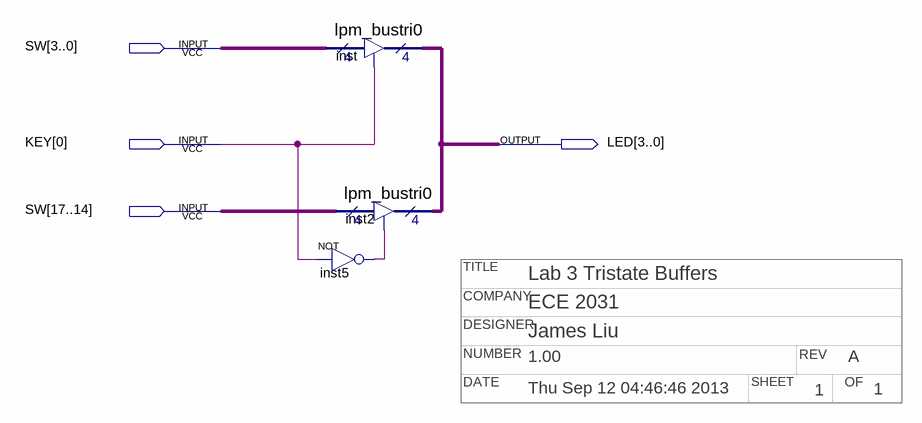
[diagram p0: schematic sheet]
// Quartus schematic tristate.bdf as structural Verilog: 3 symbols, 4 pins
// Title block: TITLE: Lab 3 Tristate Buffers; COMPANY: ECE 2031; DESIGNER: James Liu; NUMBER: 1.00; REV: A; DATE: Thu Sep 12 04:46:46 2013; SHEET: 1; OF: 1
module tristate (
  input  [17:0] SW,
  input  [0:0] KEY,
  output [3:0] LED
);

  wire inst5_out;

  lpm_bustri0 inst (.enabledt(KEY[0]), .data(SW[3:0]), .tridata(LED));
  lpm_bustri0 inst2 (.enabledt(inst5_out), .data(SW[17:14]), .tridata(LED));
  not inst5 (inst5_out, KEY[0]);
endmodule
